# Altium project MANGO.PrjPCB
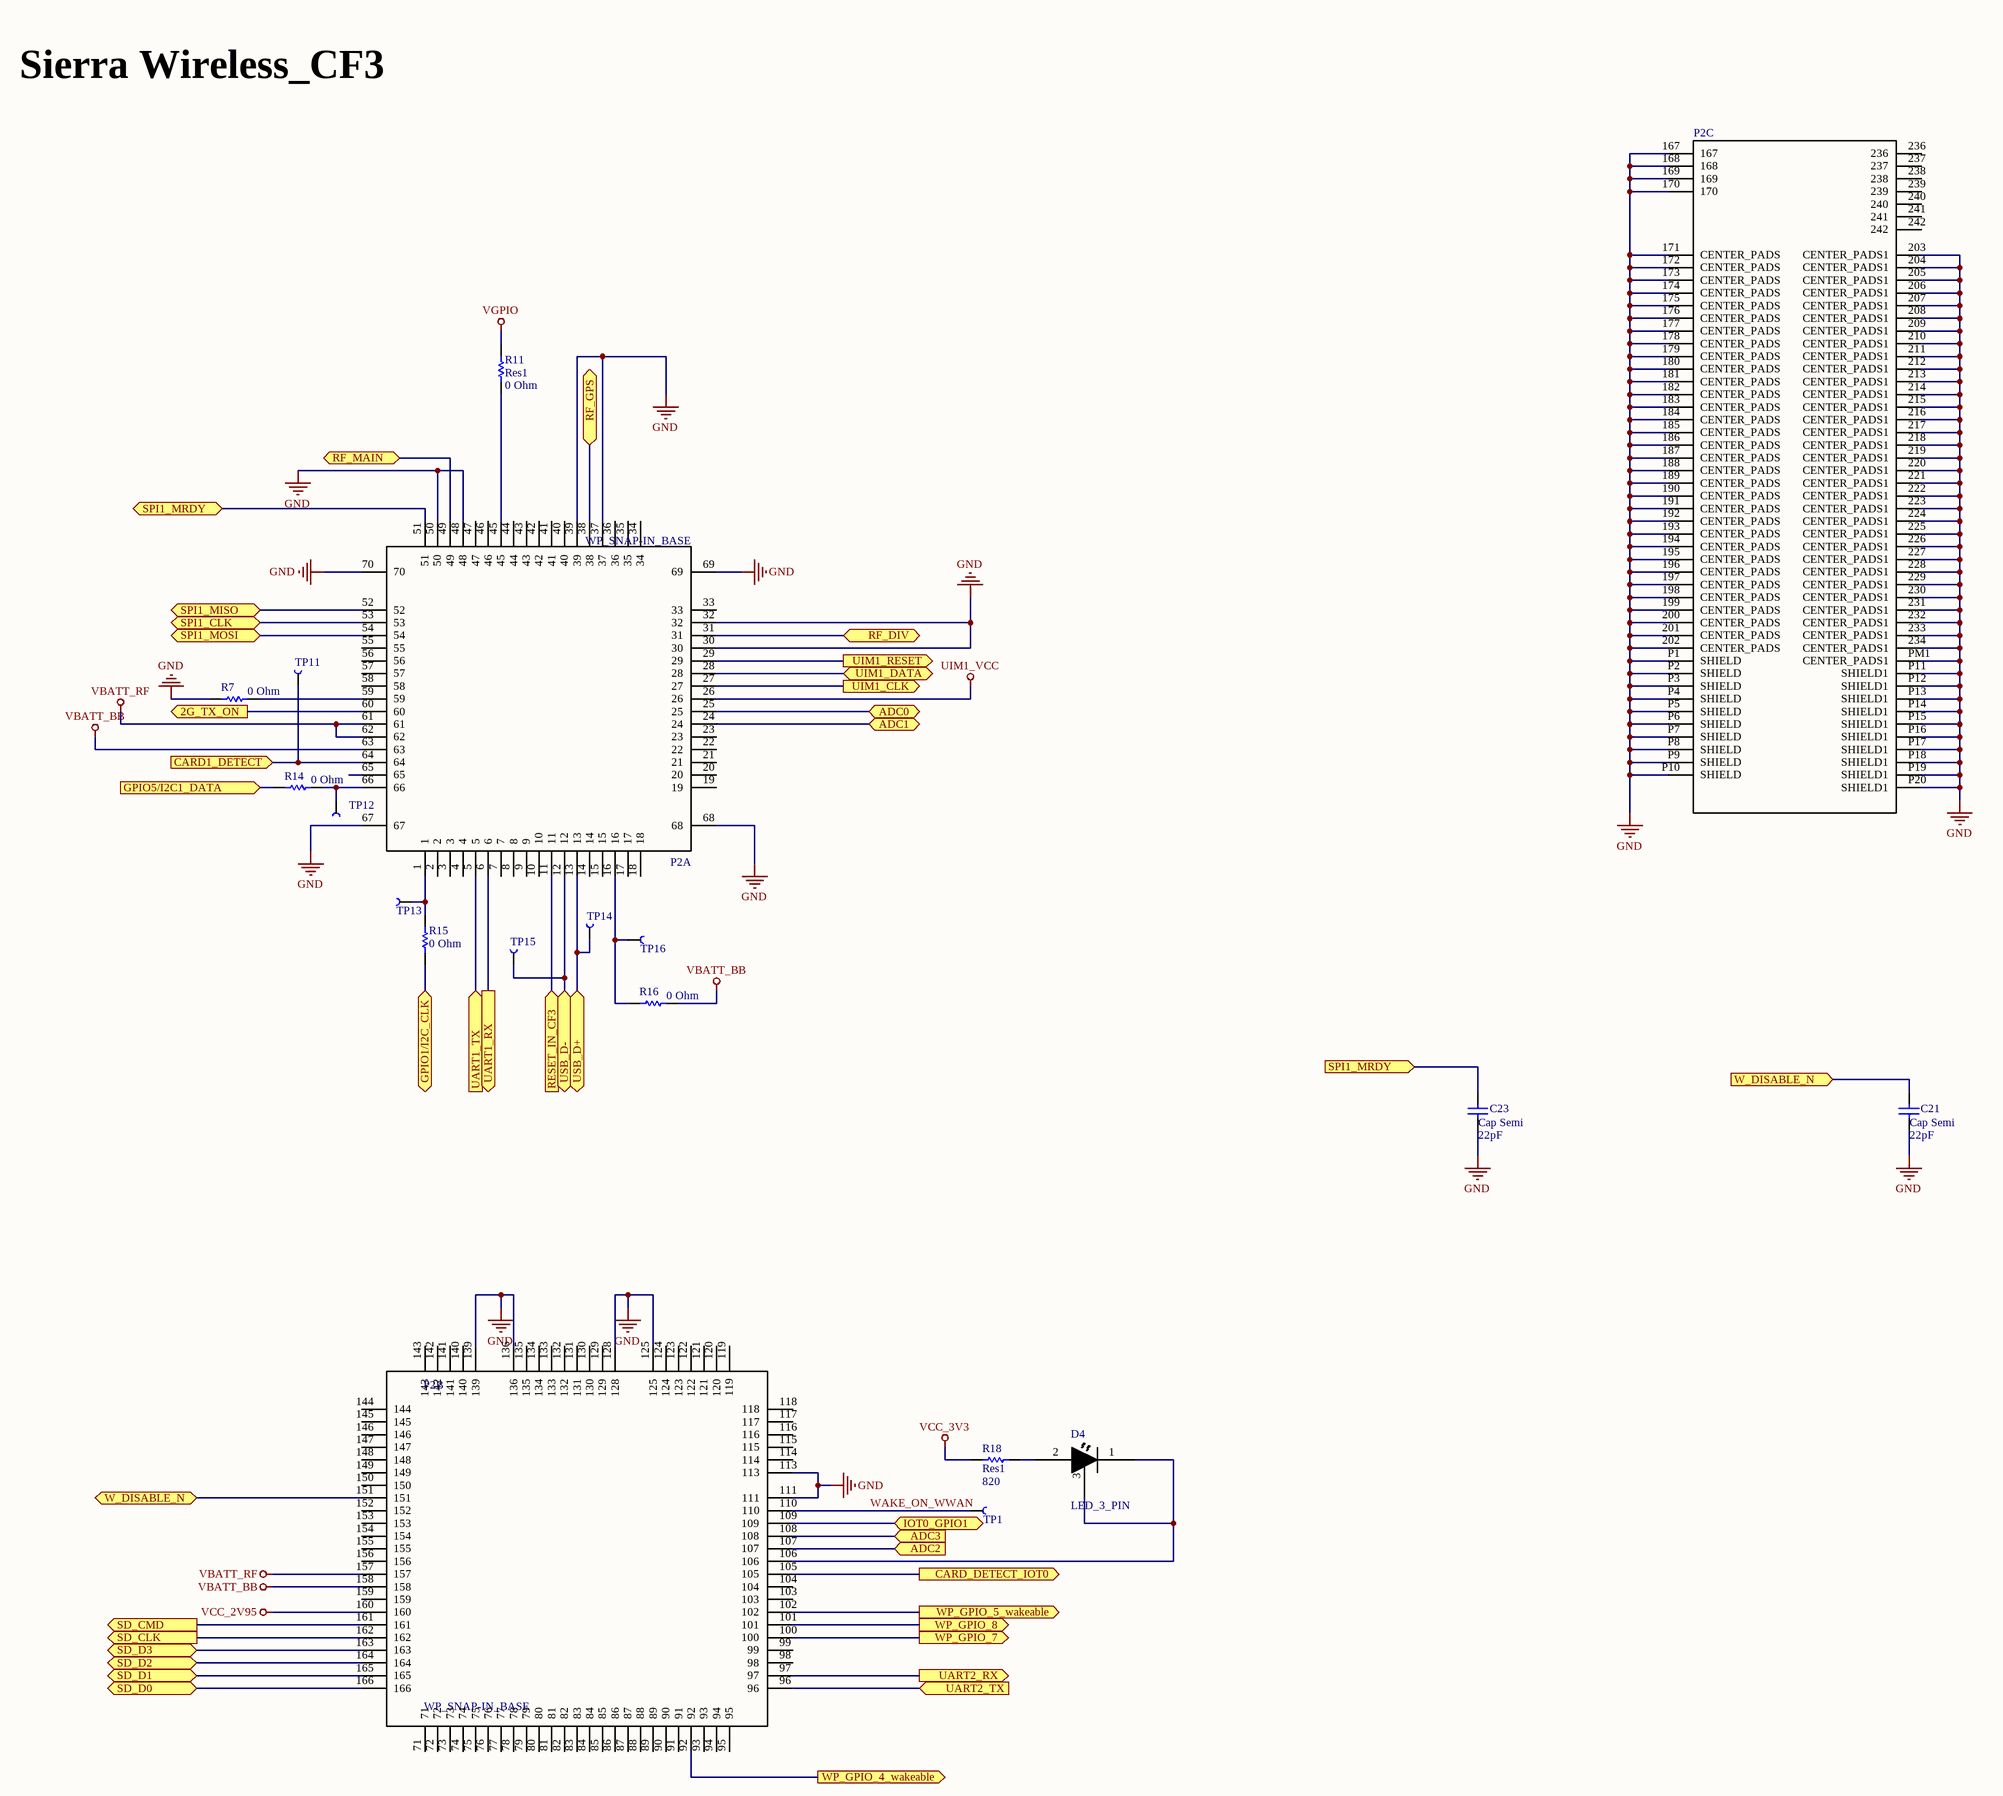
[diagram p0: Sheet2.SchDoc]
3 sheets, 73 parts. Net scope: flat (ports and power ports of the same name join across sheets).
Board file: PCB1.PcbDoc
Sheets:
  Sheet2.SchDoc
  Sheet5.SchDoc
  Sheet7.SchDoc

## Sheet Sheet2.SchDoc
size A2; Organization: Altium Limited; Address1: L3, 12a Rodborough Rd; Address2: Frenchs Forest; Address3: NSW; Address4: Australia 2086

### Parts
C21  Cap Semi  value 22pF  [CAP 0402/1005]
C23  Cap Semi  value 22pF  [CAP 0402/1005]
D4  LED_3_PIN  [LED_3_PIN]
P2  WP_SNAP-IN_BASE  [*SIERRA_WP_SNAP-IN_BASE_WP_SNAP-IN_BASE(Primary)]  (parts A,B,C of 3)
R7  value 0 Ohm  [RES 0402/1005]  (hidden comment: Res1)
R11  Res1  value 0 Ohm  [RES 0402/1005]
R14  value 0 Ohm  [RES 0402/1005]  (hidden comment: Res1)
R15  value 0 Ohm  [RES 0402/1005]  (hidden comment: Res1)
R16  value 0 Ohm  [RES 0402/1005]  (hidden comment: Res1)
R18  Res1  value 820  [RES 0402/1005]
TP1  TestPoint  [TestPoint]  (value not drawn)
TP11  TestPoint  [TestPoint]  (value not drawn)
TP12  TestPoint  [TestPoint]  (value not drawn)
TP13  TestPoint  [TestPoint]  (value not drawn)
TP14  TestPoint  [TestPoint]  (value not drawn)
TP15  TestPoint  [TestPoint]  (value not drawn)
TP16  TestPoint  [TestPoint]  (value not drawn)

### Ports
2G_TX_ON (out), ADC0 (bidir), ADC1 (bidir), ADC2 (in), ADC3 (in), CARD1_DETECT (in), CARD_DETECT_IOT0 (out), GPIO1/I2C_CLK (bidir), GPIO5/I2C1_DATA (in), IOT0_GPIO1 (bidir), RESET_IN_CF3 (in), RF_DIV (bidir), RF_GPS (bidir), RF_MAIN (bidir), SD_CLK (out), SD_CMD (out), SD_D0 (bidir), SD_D1 (bidir), SD_D2 (bidir), SD_D3 (bidir), SPI1_CLK (bidir), SPI1_MISO (bidir), SPI1_MOSI (bidir), SPI1_MRDY (bidir), SPI1_MRDY (in), UART1_RX (out), UART1_TX (in), UART2_RX (out), UART2_TX (in), UIM1_CLK (out), UIM1_DATA (bidir), UIM1_RESET (out), USB_D+ (bidir), USB_D- (bidir), W_DISABLE_N (bidir), W_DISABLE_N (in), WP_GPIO_4_wakeable (out), WP_GPIO_5_wakeable (out), WP_GPIO_7 (out), WP_GPIO_8 (out)

### Nets
GND: C21.1 C23.1 P2.30 P2.32 P2.37 P2.39 P2.48 P2.50 P2.67 P2.68 P2.69 P2.70 P2.111 P2.113 P2.125 P2.128 P2.136 P2.139 P2.167 P2.168 P2.169 P2.170 P2.171(CENTER_PADS) P2.172(CENTER_PADS) P2.173(CENTER_PADS) P2.174(CENTER_PADS) P2.175(CENTER_PADS) P2.176(CENTER_PADS) P2.177(CENTER_PADS) P2.178(CENTER_PADS) P2.179(CENTER_PADS) P2.180(CENTER_PADS) P2.181(CENTER_PADS) P2.182(CENTER_PADS) P2.183(CENTER_PADS) P2.184(CENTER_PADS) P2.185(CENTER_PADS) P2.186(CENTER_PADS) P2.187(CENTER_PADS) P2.188(CENTER_PADS) P2.189(CENTER_PADS) P2.190(CENTER_PADS) P2.191(CENTER_PADS) P2.192(CENTER_PADS) P2.193(CENTER_PADS) P2.194(CENTER_PADS) P2.195(CENTER_PADS) P2.196(CENTER_PADS) P2.197(CENTER_PADS) P2.198(CENTER_PADS) P2.199(CENTER_PADS) P2.200(CENTER_PADS) P2.201(CENTER_PADS) P2.202(CENTER_PADS) P2.203(CENTER_PADS1) P2.204(CENTER_PADS1) P2.205(CENTER_PADS1) P2.206(CENTER_PADS1) P2.207(CENTER_PADS1) P2.208(CENTER_PADS1) P2.209(CENTER_PADS1) P2.210(CENTER_PADS1) P2.211(CENTER_PADS1) P2.212(CENTER_PADS1) P2.213(CENTER_PADS1) P2.214(CENTER_PADS1) P2.215(CENTER_PADS1) P2.216(CENTER_PADS1) P2.217(CENTER_PADS1) P2.218(CENTER_PADS1) P2.219(CENTER_PADS1) P2.220(CENTER_PADS1) P2.221(CENTER_PADS1) P2.222(CENTER_PADS1) P2.223(CENTER_PADS1) P2.224(CENTER_PADS1) P2.225(CENTER_PADS1) P2.226(CENTER_PADS1) P2.227(CENTER_PADS1) P2.228(CENTER_PADS1) P2.229(CENTER_PADS1) P2.230(CENTER_PADS1) P2.231(CENTER_PADS1) P2.232(CENTER_PADS1) P2.233(CENTER_PADS1) P2.234(CENTER_PADS1) P2.P1(SHIELD) P2.P2(SHIELD) P2.P3(SHIELD) P2.P4(SHIELD) P2.P5(SHIELD) P2.P6(SHIELD) P2.P7(SHIELD) P2.P8(SHIELD) P2.P9(SHIELD) P2.P10(SHIELD) P2.P11(SHIELD1) P2.P12(SHIELD1) P2.P13(SHIELD1) P2.P14(SHIELD1) P2.P15(SHIELD1) P2.P16(SHIELD1) P2.P17(SHIELD1) P2.P18(SHIELD1) P2.P19(SHIELD1) P2.P20(SHIELD1) P2.PM1(CENTER_PADS1) R7.2
UIM1_VCC: P2.26
VBATT_BB: P2.63 P2.158 R16.1
VBATT_RF: P2.61 P2.62 P2.157
VCC_2V95: P2.160
VCC_3V3: R18.2
VGPIO: R11.1
WAKE_ON_WWAN: P2.110 TP1.1(TP)
NetC21_2: C21.2 P2.151 ; port W_DISABLE_N
NetC23_2: C23.2 P2.51 ; port SPI1_MRDY
NetD4_1: D4.1 D4.3 P2.106
NetD4_2: D4.2 R18.1
NetI2_3: P2.13 TP14.1(TP) ; port USB_D+
NetI2_4: P2.12 TP15.1(TP) ; port USB_D-
NetP2_1: P2.1 R15.1 TP13.1(TP)
NetP2_5: P2.5 ; port UART1_TX
NetP2_6: P2.6 ; port UART1_RX
NetP2_11: P2.11 ; port RESET_IN_CF3
NetP2_16: P2.16 R16.2 TP16.1(TP)
NetP2_24: P2.24 ; port ADC1
NetP2_25: P2.25 ; port ADC0
NetP2_27: P2.27 ; port UIM1_CLK
NetP2_28: P2.28 ; port UIM1_DATA
NetP2_29: P2.29 ; port UIM1_RESET
NetP2_31: P2.31 ; port RF_DIV
NetP2_38: P2.38 ; port RF_GPS
NetP2_45: P2.45 R11.2
NetP2_49: P2.49 ; port RF_MAIN
NetP2_52: P2.52 ; port SPI1_MISO
NetP2_53: P2.53 ; port SPI1_CLK
NetP2_54: P2.54 ; port SPI1_MOSI
NetP2_59: P2.59 R7.1
NetP2_60: P2.60 ; port 2G_TX_ON
NetP2_64: P2.64 TP11.1(TP) ; port CARD1_DETECT
NetP2_66: P2.66 R14.1 TP12.1(TP)
NetP2_92: P2.92 ; port WP_GPIO_4_wakeable
NetP2_96: P2.96 ; port UART2_TX
NetP2_97: P2.97 ; port UART2_RX
NetP2_100: P2.100 ; port WP_GPIO_7
NetP2_101: P2.101 ; port WP_GPIO_8
NetP2_102: P2.102 ; port WP_GPIO_5_wakeable
NetP2_105: P2.105 ; port CARD_DETECT_IOT0
NetP2_107: P2.107 ; port ADC2
NetP2_108: P2.108 ; port ADC3
NetP2_109: P2.109 ; port IOT0_GPIO1
NetP2_161: P2.161 ; port SD_CMD
NetP2_162: P2.162 ; port SD_CLK
NetP2_163: P2.163 ; port SD_D3
NetP2_164: P2.164 ; port SD_D2
NetP2_165: P2.165 ; port SD_D1
NetP2_166: P2.166 ; port SD_D0
NetR14_2: R14.2 ; port GPIO5/I2C1_DATA
NetR15_2: R15.2 ; port GPIO1/I2C_CLK

Not connected (* = marked no-connect by the designer): P2 2 3 4 7 8 9 10 14 15 17 18 19 20 21 22 23 33 34 35 36 40 41 42 43 44 46 47 55 56 57 58 65 71 72 73 74 75 76 77 78 79 80 81 82 83 84 85 86 87 88 89 90 91 93 94 95 98 99 103 104 114 115 116 117 118 119 120 121 122 123 124 129 130 131 132 133 134 135 140 141 142 143 144 145 146 147 148 149 150 152 153 154 155 156 159 236 237 238 239 240 241 242

### Notes on the sheet
- Sierra Wireless_CF3
- Title
- Size:
- Date:
- File:
- A2
- Number:
- Time:
- Revision:
- Sheet
- of

### Library data of the parts
C21 C23 = Cap Semi: CAP CER 22PF 50V NP0 0402; Part Number: UMK105CG220JV-F; Available: Obsolete; Published: 8-Jun-2000; LatestRevisionDate: 29-May-2009; LatestRevisionNote: IPC-7351 Footprint Added.; PackageReference: C1206; PackageDescription: Chip Capacitor; Supplier Link: https://www.digikey.com/product-detail/en/taiyo-yuden/UMK105CG220JV-F/587-1203-1-ND/930980
D4 = LED_3_PIN: Yellow-Green 573nm LED Indication - Discrete 2V 2-SMD, No Lead; Part Number: 12-21SYGC/S530-E2/TR8; Supplier Link: https://www.digikey.com/product-detail/en/everlight-electronics-co-ltd/12-21SYGC-S530-E2-TR8/1080-1451-1-ND/5308153
P2 = WP_SNAP-IN_BASE: Snap-In Socket Base For Wp Series Mcu; Part Number: WP SNAP-IN BASE; MF: Sierra Wireless; Availability: Unavailable; SnapEDA_Link: https://www.snapeda.com/parts/WP%20SNAP-IN%20BASE/Sierra%20Wireless/view-part/?ref=snap; Price: None; Package: None; Value: *; Supplier Link: https://www.digikey.com/product-detail/en/sierra-wireless/WP-SNAP-IN-BASE_6000636/1645-1026-1-ND/6565779
R7 R11 R14-R16 = Res1: 0 Ohms Jumper  Chip Resistor 0402 (1005 Metric) Automotive AEC-Q200 Metal Element; Part Number: RK73Z1ETTP; Published: 8-Jun-2000; LatestRevisionDate: 17-Jul-2002; LatestRevisionNote: Re-released for DXP Platform.; PackageReference: AXIAL-0.3; PackageDescription: Axial Device, Thru-Hole; 2 Leads; 0.3 in Pin Spacing; Supplier Link: https://www.digikey.com/product-detail/en/koa-speer-electronics-inc/RK73Z1ETTP/2019-RK73Z1ETTPCT-ND/9846740
R18 = Res1: 820 Ohms ±5% 0.1W, 1/10W Chip Resistor 0402 (1005 Metric) Automotive AEC-Q200 Thick Film; Part Number: RK73B1ETTP821J; Published: 8-Jun-2000; LatestRevisionDate: 17-Jul-2002; LatestRevisionNote: Re-released for DXP Platform.; PackageReference: AXIAL-0.3; PackageDescription: Axial Device, Thru-Hole; 2 Leads; 0.3 in Pin Spacing; Supplier Link: https://www.digikey.com/product-detail/en/koa-speer-electronics-inc/RK73B1ETTP821J/2019-RK73B1ETTP821JCT-ND/9846073

## Sheet Sheet5.SchDoc
size A3; Organization: Altium Limited; Address1: L3, 12a Rodborough Rd; Address2: Frenchs Forest; Address3: NSW; Address4: Australia 2086
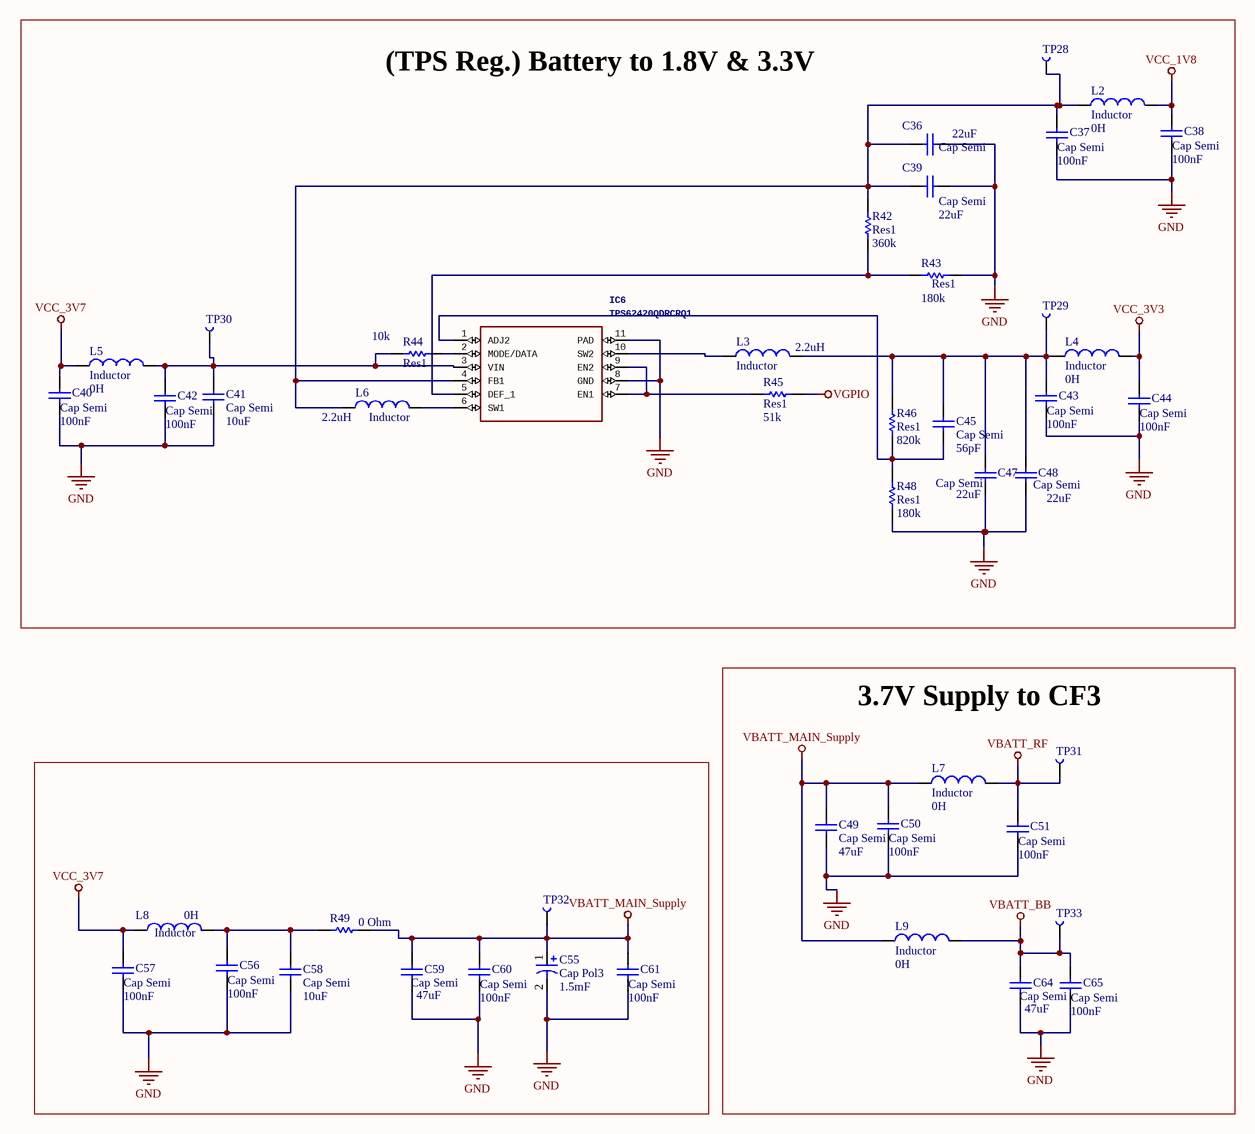
[diagram p1: Sheet5.SchDoc]

### Parts
C36  Cap Semi  value 22uF  [CAP 0603/1608]
C37  Cap Semi  value 100nF  [CAP 0402/1005]
C38  Cap Semi  value 100nF  [CAP 0402/1005]
C39  Cap Semi  value 22uF  [CAP 0603/1608]
C40  Cap Semi  value 100nF  [CAP 0402/1005]
C41  Cap Semi  value 10uF  [CAP 0805/2012]
C42  Cap Semi  value 100nF  [CAP 0402/1005]
C43  Cap Semi  value 100nF  [CAP 0402/1005]
C44  Cap Semi  value 100nF  [CAP 0402/1005]
C45  Cap Semi  value 56pF  [CAP 0402/1005]
C47  Cap Semi  value 22uF  [CAP 0603/1608]
C48  Cap Semi  value 22uF  [CAP 0603/1608]
C49  Cap Semi  value 47uF  [CAP 1206/3216]
C50  Cap Semi  value 100nF  [CAP 0402/1005]
C51  Cap Semi  value 100nF  [CAP 0402/1005]
C55  Cap Pol3  value 1.5mF  [F720J158MMC]
C56  Cap Semi  value 100nF  [CAP 0402/1005]
C57  Cap Semi  value 100nF  [CAP 0402/1005]
C58  Cap Semi  value 10uF  [CAP 0603/1608]
C59  Cap Semi  value 47uF  [CAP 1206/3216]
C60  Cap Semi  value 100nF  [CAP 0402/1005]
C61  Cap Semi  value 100nF  [CAP 0402/1005]
C64  Cap Semi  value 47uF  [CAP 1206/3216]
C65  Cap Semi  value 100nF  [CAP 0402/1005]
IC6  TPS62420QDRCRQ1  [SON50P300X300X100-11N - 3D]
L2  Inductor  value 0H  [INDC1608L]
L3  Inductor  value 2.2uH  [0402-A]
L4  Inductor  value 0H  [INDC1608L]
L5  Inductor  value 0H  [INDC1608L]
L6  Inductor  value 2.2uH  [0402-A]
L7  Inductor  value 0H  [INDC1608L]
L8  Inductor  value 0H  [INDC1608L]
L9  Inductor  value 0H  [INDC1608L]
R42  Res1  value 360k  [RES 0402/1005]
R43  Res1  value 180k  [RES 0402/1005]
R44  Res1  value 10k  [RES 0402/1005]
R45  Res1  value 51k  [RES 0402/1005]
R46  Res1  value 820k  [RES 0402/1005]
R48  Res1  value 180k  [RES 0402/1005]
R49  value 0 Ohm  [RES 0402/1005]  (hidden comment: Res1)
TP28  TestPoint  [TestPoint]  (value not drawn)
TP29  TestPoint  [TestPoint]  (value not drawn)
TP30  TestPoint  [TestPoint]  (value not drawn)
TP31  TestPoint  [TestPoint]  (value not drawn)
TP32  TestPoint  [TestPoint]  (value not drawn)
TP33  TestPoint  [TestPoint]  (value not drawn)

### Blocks framed on the sheet
(TPS Reg.) Battery to 1.8V & 3.3V: C36-C45 C47 C48 IC6 L2-L6 R42-R46 R48 TP28-TP30
3.7V Supply to CF3: C49-C51 C64 C65 L7 L9 TP31 TP33

### Nets
GND: C36.1 C37.1 C38.1 C39.1 C40.1 C41.1 C42.1 C43.1 C44.1 C47.1 C48.1 C49.1 C50.1 C51.1 C55.2 C56.1 C57.1 C58.1 C59.1 C60.1 C61.1 C64.1 C65.1 IC6.8(GND) IC6.11(PAD) R43.1 R48.1
VBATT_BB: C64.2 C65.2 L9.2 TP33.1(TP)
VBATT_MAIN_Supply: C49.2 C50.2 C55.1 C59.2 C60.2 C61.2 L7.1 L9.1 R49.2 TP32.1(TP)
VBATT_RF: C51.2 L7.2 TP31.1(TP)
VCC_1V8: C38.2 L2.2
VCC_3V3: C44.2 L4.2
VCC_3V7: C40.2 C57.2 L5.1 L8.1
VGPIO: R45.2
NetC36_2: C36.2 C37.2 C39.2 IC6.4(FB1) L2.1 L6.1 R42.1 TP28.1(TP)
NetC41_2: C41.2 C42.2 IC6.3(VIN) L5.2 R44.1 TP30.1(TP)
NetC43_2: C43.2 C45.2 C47.2 C48.2 L3.2 L4.1 R46.2 TP29.1(TP)
NetC45_1: C45.1 IC6.1(ADJ2) R46.1 R48.2
NetC56_2: C56.2 C58.2 L8.2 R49.1
NetIC6_2: IC6.2(MODE/DATA) R44.2
NetIC6_5: IC6.5(DEF_1) R42.2 R43.2
NetIC6_6: IC6.6(SW1) L6.2
NetIC6_7: IC6.7(EN1) IC6.9(EN2) R45.1
NetIC6_10: IC6.10(SW2) L3.1

### Notes on the sheet
- Title
- Size:
- Date:
- A3
- Number:
- Time:
- Revision:
- Sheet
- of
- File:

### Library data of the parts
C36 C39 C47 C48 = Cap Semi: 22µF ±20% 6.3V Ceramic Capacitor X5R 0603 (1608 Metric); Part Number: GRM188R60J226MEA0D; LatestRevisionDate: 29-May-2009; LatestRevisionNote: IPC-7351 Footprint Added.; PackageReference: C1206; Publisher: Altium Limited; PackageDescription: Chip Capacitor; Supplier Link: https://www.digikey.com/product-detail/en/murata-electronics-north-america/GRM188R60J226MEA0D/490-7611-1-ND/4280544
C37 C38 C43 C44 C50 C51 C60 C61 C65 = Cap Semi: 0.1µF ±10% 10V Ceramic Capacitor X5R 0402 (1005 Metric); Part Number: LMK105BJ104KV-F; Published: 8-Jun-2000; LatestRevisionDate: 29-May-2009; LatestRevisionNote: IPC-7351 Footprint Added.; PackageReference: C1206; PackageDescription: Chip Capacitor; Supplier Link: https://www.digikey.com/product-detail/en/taiyo-yuden/LMK105BJ104KV-F/587-1227-1-ND/931004
C40 C42 C56 C57 = Cap Semi: 0.1µF -20%, +80% 16V Ceramic Capacitor Y5V (F) 0402 (1005 Metric); Part Number: VJ0402V104ZXJCW1BC; Published: 8-Jun-2000; LatestRevisionDate: 29-May-2009; LatestRevisionNote: IPC-7351 Footprint Added.; PackageReference: C1206; PackageDescription: Chip Capacitor; Supplier Link: https://www.digikey.com/product-detail/en/vishay-vitramon/VJ0402V104ZXJCW1BC/720-1523-1-ND/420979
C41 = Cap Semi: 10µF ±10% 10V Ceramic Capacitor X5R 0805 (2012 Metric); Part Number: LMK212BJ106KG-T; LatestRevisionDate: 29-May-2009; LatestRevisionNote: IPC-7351 Footprint Added.; PackageReference: C1206; Publisher: Altium Limited; PackageDescription: Chip Capacitor; Supplier Link: https://www.digikey.com/product-detail/en/taiyo-yuden/LMK212BJ106KG-T/587-1300-1-ND/931077
C45 = Cap Semi: 56pF ±5% 50V Ceramic Capacitor C0G, NP0 0402 (1005 Metric); Part Number: UMK105CG560JV-F; LatestRevisionDate: 29-May-2009; LatestRevisionNote: IPC-7351 Footprint Added.; PackageReference: C1206; Publisher: Altium Limited; PackageDescription: Chip Capacitor; Supplier Link: https://www.digikey.com/product-detail/en/taiyo-yuden/UMK105CG560JV-F/587-1208-1-ND/930985
C49 C59 C64 = Cap Semi: 47µF ±20% 10V Ceramic Capacitor X5R 1206 (3216 Metric); Part Number: LMK316BJ476ML-T; LatestRevisionDate: 29-May-2009; LatestRevisionNote: IPC-7351 Footprint Added.; PackageReference: C1206; Publisher: Altium Limited; PackageDescription: Chip Capacitor; Supplier Link: https://www.digikey.com/product-detail/en/taiyo-yuden/LMK316BJ476ML-T/587-1780-1-ND/1212796
C55 = Cap Pol3: 1500µF Conformal Coated Tantalum Capacitors 6.3V 2824 (7260 Metric) 140 mOhm; Available: 0; Published: 8-Jun-2000; LatestRevisionDate: 29-May-2009; LatestRevisionNote: IPC-7351 Footprint Added.; PackageReference: C0805; Publisher: Altium Limited; PackageDescription: Chip Capacitor; Part Number: F720J158MMC; Supplier Link: https://www.digikey.com/product-detail/en/avx-corporation/F720J158MMC/478-8067-1-ND/4005932
C58 = Cap Semi: 10µF ±20% 10V Ceramic Capacitor X5R 0603 (1608 Metric); Part Number: GRM188R61A106ME69D; LatestRevisionDate: 29-May-2009; LatestRevisionNote: IPC-7351 Footprint Added.; PackageReference: C1206; Publisher: Altium Limited; PackageDescription: Chip Capacitor; Supplier Link: https://www.digikey.com/product-detail/en/murata-electronics-north-america/GRM188R61A106ME69D/490-10475-1-ND/5026393
IC6 = TPS62420QDRCRQ1: Buck Switching Regulator IC Positive Adjustable 0.6V 2 Output 600mA, 1A 10-VFDFN Exposed Pad; Manufacturer_Name: Texas Instruments; Part Number: TPS62420DRCR; GateName_1: G$1; SymbolName_1: TPS62420QDRCRQ1; LibraryName: TPS62420QDRCRQ1; DeviceSetName: TPS62420QDRCRQ1; Package: SON50P300X300X100-11N; Manufacturer_Part_Number: TPS62420QDRCRQ1; Mouser_Price-Stock: https://www.mouser.com/Search/Refine.aspx?Keyword=595-TPS62420QDRCRQ1; Height: mm; Supplier Link: https://www.digikey.com/product-detail/en/texas-instruments/TPS62420DRCR/296-25650-1-ND/2203742
L2 L4 L5 = Inductor: 220 Ohms @ 100MHz 1 Power Line Ferrite Bead 0603 (1608 Metric) 2.2A 50 mOhm; Part Number: MPZ1608S221ATA00; Code_IEC: 1005; Published: 8-Jun-2000; LatestRevisionDate: 29-May-2009; LatestRevisionNote: IPC-7351 Footprint Added.; PackageReference: 0402-A; Publisher: Altium Limited; PackageDescription: Chip Inductor; Code_JEITA: 0402; Supplier Link: https://www.digikey.com/product-detail/en/tdk-corporation/MPZ1608S221ATA00/445-1565-1-ND/571895
L3 L6 = Inductor: Part Number: MIPF2016D2R2; Code_IEC: 1005; Published: 8-Jun-2000; LatestRevisionDate: 29-May-2009; LatestRevisionNote: IPC-7351 Footprint Added.; PackageReference: 0402-A; Publisher: Altium Limited; PackageDescription: Chip Inductor; Code_JEITA: 0402
  L6: Supplier Link: *
L7-L9 = Inductor: 120 Ohms @ 100MHz 1 Power Line Ferrite Bead 0603 (1608 Metric) 2.7A 35 mOhm; Part Number: BKP1608HS121-T; Code_IEC: 1005; Published: 8-Jun-2000; LatestRevisionDate: 29-May-2009; LatestRevisionNote: IPC-7351 Footprint Added.; PackageReference: 0402-A; Publisher: Altium Limited; PackageDescription: Chip Inductor; Code_JEITA: 0402; Supplier Link: https://www.digikey.com/product-detail/en/taiyo-yuden/BKP1608HS121-T/587-1923-1-ND/1465393
R42 = Res1: 360 kOhms ±1% 0.063W, 1/16W Chip Resistor 0402 (1005 Metric) Automotive AEC-Q200 Thick Film; Part Number: MCR01MZPF3603; Available: 0; Published: 8-Jun-2000; LatestRevisionDate: 17-Jul-2002; LatestRevisionNote: Re-released for DXP Platform.; PackageReference: AXIAL-0.3; PackageDescription: Axial Device, Thru-Hole; 2 Leads; 0.3 in Pin Spacing; Supplier Link: https://www.digikey.com/product-detail/en/rohm-semiconductor/MCR01MZPF3603/RHM360KLCT-ND/628144; Supplier Link 2: https://www.digikey.com/product-detail/en/yageo/AC0402FR-07360KL/311-360KLBCT-ND/2828125; Part Number 2: AC0402FR-07360KL
R43 R48 = Res1: 180 kOhms ±1% 0.1W, 1/10W Chip Resistor 0402 (1005 Metric) Automotive AEC-Q200 Thick Film; Part Number: RK73H1ETTP1803F; Published: 8-Jun-2000; LatestRevisionDate: 17-Jul-2002; LatestRevisionNote: Re-released for DXP Platform.; PackageReference: AXIAL-0.3; PackageDescription: Axial Device, Thru-Hole; 2 Leads; 0.3 in Pin Spacing; Supplier Link: https://www.digikey.com/product-detail/en/koa-speer-electronics-inc/RK73H1ETTP1803F/2019-RK73H1ETTP1803FCT-ND/9846242
R44 = Res1: 10 kOhms ±5% 0.063W, 1/16W Chip Resistor 0402 (1005 Metric) Automotive AEC-Q200 Thick Film; Part Number: MCR01MZPJ103; Available: 0; Published: 8-Jun-2000; LatestRevisionDate: 17-Jul-2002; LatestRevisionNote: Re-released for DXP Platform.; PackageReference: AXIAL-0.3; PackageDescription: Axial Device, Thru-Hole; 2 Leads; 0.3 in Pin Spacing; Supplier Link: https://www.digikey.com/product-detail/en/rohm-semiconductor/MCR01MZPJ103/RHM10KJCT-ND/628226; Supplier Link 2: https://www.digikey.fi/product-detail/en/vishay-dale/CRCW040210K0JNED/541-10KJCT-ND/1182708?cur=USD&lang=en; Part Number 2: CRCW040210K0JNED
R45 = Res1: 51 kOhms ±5% 0.063W, 1/16W Chip Resistor 0402 (1005 Metric); Part Number: MCR01MZPJ513; Published: 8-Jun-2000; LatestRevisionDate: 17-Jul-2002; LatestRevisionNote: Re-released for DXP Platform.; PackageReference: AXIAL-0.3; PackageDescription: Axial Device, Thru-Hole; 2 Leads; 0.3 in Pin Spacing; Supplier Link: https://www.verical.com/pd/rohm-semiconductor-fixed-single---surface-mount-MCR01MZPJ513-450205?utm_campaign=octopart_2018&utm_currency=USD&utm_keyword=MCR01MZPJ513&utm_medium=aggregator&utm_content=inv_listing&utm_source=octopart; Supplier Link 2: https://www.digikey.ee/product-detail/en/bourns-inc/CR0402-JW-513GLF/CR0402-JW-513GLFCT-ND/8604290; Part Number 2: CR0402-JW-513GLF
R46 = Res1: 820 kOhms ±1% 0.063W, 1/16W Chip Resistor 0402 (1005 Metric) Moisture Resistant Thick Film; Part Number: RC0402FR-07820KL; Published: 8-Jun-2000; LatestRevisionDate: 17-Jul-2002; LatestRevisionNote: Re-released for DXP Platform.; PackageReference: AXIAL-0.3; PackageDescription: Axial Device, Thru-Hole; 2 Leads; 0.3 in Pin Spacing; Supplier Link: https://www.digikey.com/product-detail/en/yageo/RC0402FR-07820KL/YAG3240CT-ND/5282105
R49 = Res1: as R7 on sheet Sheet2; Published: 8-Jun-2000; LatestRevisionDate: 17-Jul-2002; LatestRevisionNote: Re-released for DXP Platform.; PackageReference: AXIAL-0.3; PackageDescription: Axial Device, Thru-Hole; 2 Leads; 0.3 in Pin Spacing; Supplier Link: https://www.digikey.com/product-detail/en/koa-speer-electronics-inc/RK73Z1ETTP/2019-RK73Z1ETTPCT-ND/9846740

## Sheet Sheet7.SchDoc
size A4; Organization: Altium Limited; Address1: L3, 12a Rodborough Rd; Address2: Frenchs Forest; Address3: NSW; Address4: Australia 2086
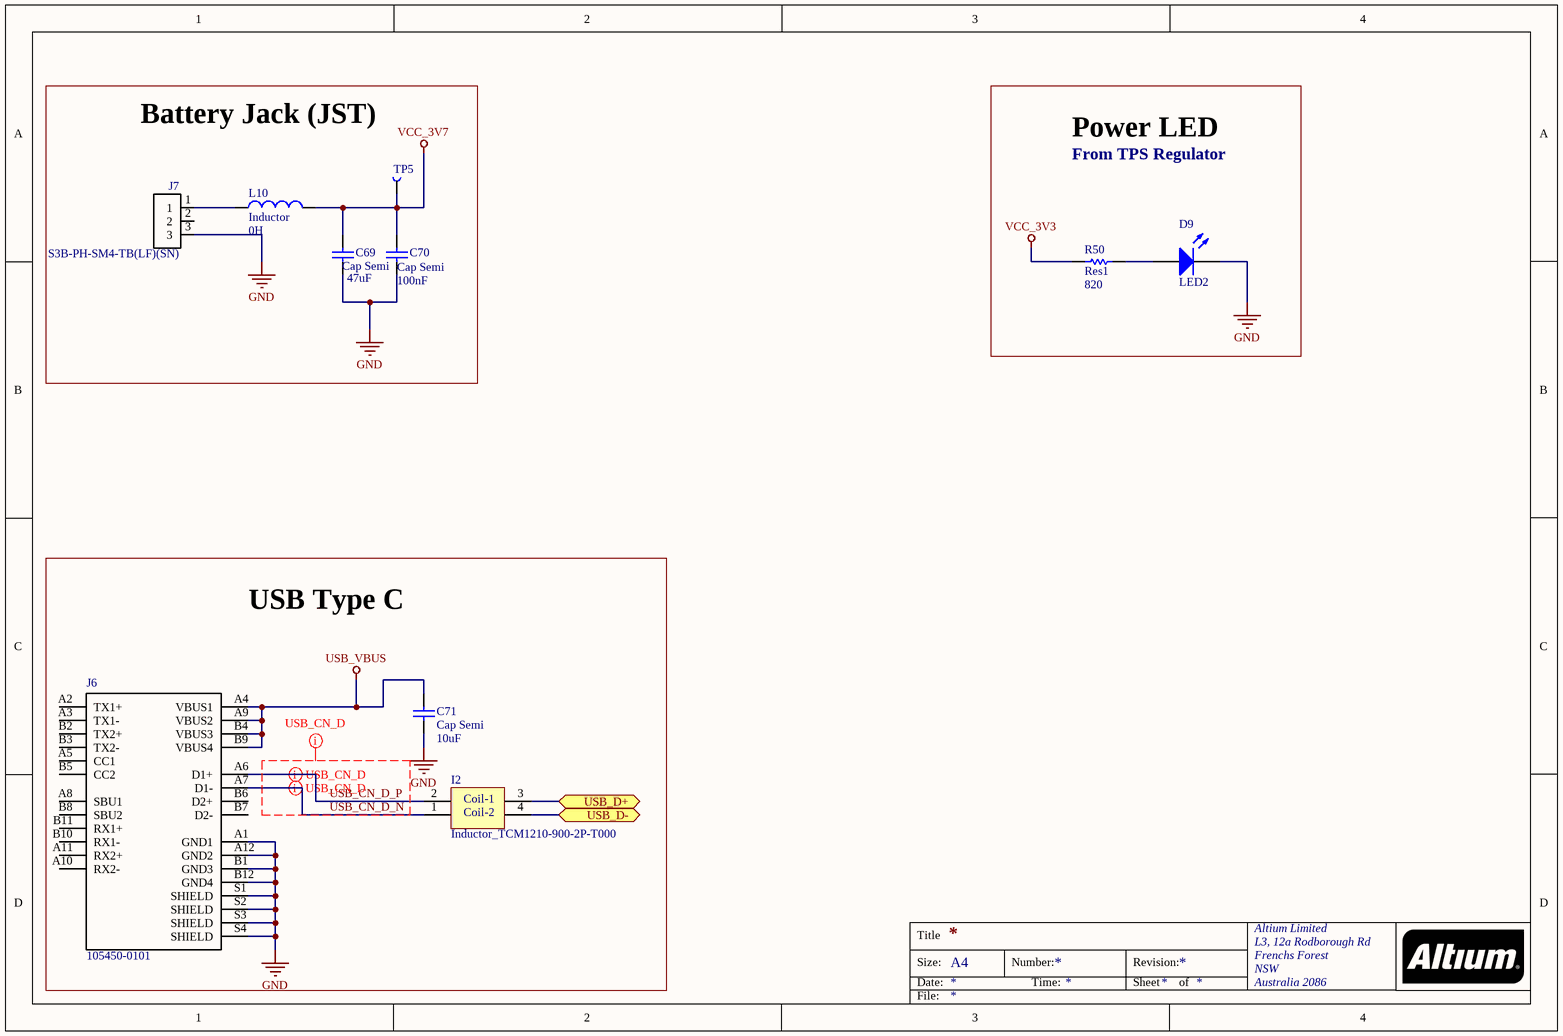
[diagram p2: Sheet7.SchDoc]

### Parts
C69  Cap Semi  value 47uF  [CAP 1206/3216]
C70  Cap Semi  value 100nF  [CAP 0402/1005]
C71  Cap Semi  value 10uF  [CAP 0603/1608]
D9  LED2  [LED_0603 - 3D]
I2  Inductor_TCM1210-900-2P-T000  [Inductor_TCM1210-900-2P-T000]
J6  105450-0101  [*MOLEX_105450-0101]
J7  S3B-PH-SM4-TB(LF)(SN)  [*JST_S3B-PH-SM4-TB(LF)(SN)]
L10  Inductor  value 0H  [INDC1608L]
R50  Res1  value 820  [RES 0402/1005]
TP5  TestPoint  [TestPoint]  (value not drawn)

### Blocks framed on the sheet
Battery Jack (JST): C69 C70 J7 L10 TP5
Power LED: D9 R50
USB Type C: C71 I2 J6

### Ports
USB_D+ (bidir), USB_D- (bidir)

### Nets
GND: C69.1 C70.1 C71.1 D9.2(K) J6.A1(GND1) J6.A12(GND2) J6.B1(GND3) J6.B12(GND4) J6.S1(SHIELD) J6.S2(SHIELD) J6.S3(SHIELD) J6.S4(SHIELD) J7.3
USB_VBUS: C71.2 J6.A4(VBUS1) J6.A9(VBUS2) J6.B4(VBUS3) J6.B9(VBUS4)
VCC_3V3: R50.2
VCC_3V7: C69.2 C70.2 L10.2 TP5.1(TP)
USB_CN_D_N: I2.1 J6.A7(D1-)
USB_CN_D_P: I2.2 J6.A6(D1+)
NetD9_1: D9.1(A) R50.1
NetI2_3: I2.3 ; port USB_D+
NetI2_4: I2.4 ; port USB_D-
NetJ7_1: J7.1 L10.1

Not connected (* = marked no-connect by the designer): J6 A2(TX1+) A3(TX1-) A5(CC1) A8(SBU1) A10(RX2-) A11(RX2+) B2(TX2+) B3(TX2-) B5(CC2) B6(D2+) B7(D2-) B8(SBU2) B10(RX1-) B11(RX1+); J7 2

### Layout directives
differential pair; net class USB_1; net class *: USB_CN_D_P
differential pair; net class USB_1: USB_CN_D_N
mark named USB_CN_D: USB_CN_D_N, USB_CN_D_P

### Notes on the sheet
- From TPS Regulator
- Title
- Size:
- Date:
- A4
- Number:
- Time:
- Revision:
- Sheet
- of
- File:
- (in symbol Inductor_TCM1210-900-2P-T000) Coil-1; Coil-2

### Library data of the parts
C69 = Cap Semi: as C49 on sheet Sheet5; LatestRevisionDate: 29-May-2009; LatestRevisionNote: IPC-7351 Footprint Added.; PackageReference: C1206; Publisher: Altium Limited; PackageDescription: Chip Capacitor; Supplier Link: https://www.digikey.com/product-detail/en/taiyo-yuden/LMK316BJ476ML-T/587-1780-1-ND/1212796
C70 = Cap Semi: as C40 on sheet Sheet5; Published: 8-Jun-2000; LatestRevisionDate: 29-May-2009; LatestRevisionNote: IPC-7351 Footprint Added.; PackageReference: C1206; PackageDescription: Chip Capacitor; Supplier Link: https://www.digikey.com/product-detail/en/vishay-vitramon/VJ0402V104ZXJCW1BC/720-1523-1-ND/420979
C71 = Cap Semi: as C58 on sheet Sheet5; LatestRevisionDate: 29-May-2009; LatestRevisionNote: IPC-7351 Footprint Added.; PackageReference: C1206; Publisher: Altium Limited; PackageDescription: Chip Capacitor; Supplier Link: https://www.digikey.com/product-detail/en/murata-electronics-north-america/GRM188R61A106ME69D/490-10475-1-ND/5026393
D9 = LED2: Green 570nm LED Indication - Discrete 1.7V 0603 (1608 Metric); Part Number: LG L29K-F2J1-24-Z; Published: 8-Jun-2000; LatestRevisionDate: 17-Jul-2002; LatestRevisionNote: Re-released for DXP Platform.; PackageVersion: Feb-2002; PackageReference: 3.2X1.6X1.1; Publisher: Altium Limited; PackageDescription: SM LED; 2 Flat Leads; Supplier Link: https://www.digikey.com/product-detail/en/osram-opto-semiconductors-inc/LG-L29K-F2J1-24-Z/475-3118-1-ND/4899549
I2 = Inductor_TCM1210-900-2P-T000: Common Mode Chokes / Filters; Part Number: TCM1210-900-2P-T000; Supplier Link: https://eu.mouser.com/ProductDetail/TDK/TCM1210-900-2P-T000?qs=%2Fha2pyFaduia2Sf2XsGzKKKR0SZzgM3gI6%2FyoQ%2FKuJLC9pPLP%252BCPyQawxd0Jpcuo
J6 = 105450-0101: USB - C USB 3.1 (USB 3.1 Gen 2, Superspeed+) Receptacle Connector 24 Position Surface Mount, Right Angle; Through Hole; Part Number: 1054500101; MF: Molex; SnapEDA_Link: https://www.snapeda.com/parts/1054500101/Molex/view-part/?ref=snap; Price: None; Availability: Unavailable; Package: None; Value: *; Supplier Link: https://www.digikey.com/product-detail/en/molex/1054500101/WM12856CT-ND/5843891
J7 = S3B-PH-SM4-TB(LF)(SN): Connector Header Surface Mount, Right Angle 3 position 0.079" (2.00mm); MF: JST Sales; SnapEDA_Link: https://www.snapeda.com/parts/S3B-PH-SM4-TB%28LF%29%28SN%29/JST%20Sales%20America%20Inc./view-part/?ref=snap; Price: None; Part Number: S3B-PH-SM4-TB(LF)(SN); Package: None; Availability: Unavailable; Value: *; Supplier Link: https://www.digikey.com/product-detail/en/jst-sales-america-inc/S3B-PH-SM4-TB-LF-SN/455-1750-1-ND/926847
L10 = Inductor: as L2 on sheet Sheet5; Published: 8-Jun-2000; LatestRevisionDate: 29-May-2009; LatestRevisionNote: IPC-7351 Footprint Added.; PackageReference: 0402-A; Publisher: Altium Limited; PackageDescription: Chip Inductor; Code_JEITA: 0402; Supplier Link: https://www.digikey.com/product-detail/en/tdk-corporation/MPZ1608S221ATA00/445-1565-1-ND/571895
R50 = Res1: as R18 on sheet Sheet2; Published: 8-Jun-2000; LatestRevisionDate: 17-Jul-2002; LatestRevisionNote: Re-released for DXP Platform.; PackageReference: AXIAL-0.3; PackageDescription: Axial Device, Thru-Hole; 2 Leads; 0.3 in Pin Spacing; Supplier Link: https://www.digikey.com/product-detail/en/koa-speer-electronics-inc/RK73B1ETTP821J/2019-RK73B1ETTP821JCT-ND/9846073

## Nets that join several sheets
GND: Sheet2 (108 pins), Sheet5 (27 pins), Sheet7 (13 pins)
VBATT_BB: Sheet2 (P2.63 P2.158 R16.1), Sheet5 (C64.2 C65.2 L9.2 TP33.1)
VBATT_RF: Sheet2 (P2.61 P2.62 P2.157), Sheet5 (C51.2 L7.2 TP31.1)
VCC_3V3: Sheet2 (R18.2), Sheet5 (C44.2 L4.2), Sheet7 (R50.2)
VCC_3V7: Sheet5 (C40.2 C57.2 L5.1 L8.1), Sheet7 (C69.2 C70.2 L10.2 TP5.1)
VGPIO: Sheet2 (R11.1), Sheet5 (R45.2)
NetI2_3: Sheet2 (P2.13 TP14.1), Sheet7 (I2.3)
NetI2_4: Sheet2 (P2.12 TP15.1), Sheet7 (I2.4)